# Altium schematic sheet [SH][SW3] V1.0.SchDoc
size A3; PageSetup: Record=PageOptions|CenterHorizontal=True|CenterVertical=True|PrintScale=0.91|XCorrection=1.00|YCorrection=1.00|PrintKind=1|BorderSize=5000000|LeftOffset=0|BottomOffset=0|Orientation=2|PaperLength=3530|PaperWidth=2500|Scale=100|PaperSource=7|PrintQuality=1200|MediaType=1|DitherType=10|PrintScaleMode=1|PaperKind=B4 (ISO)|PaperIndex=42
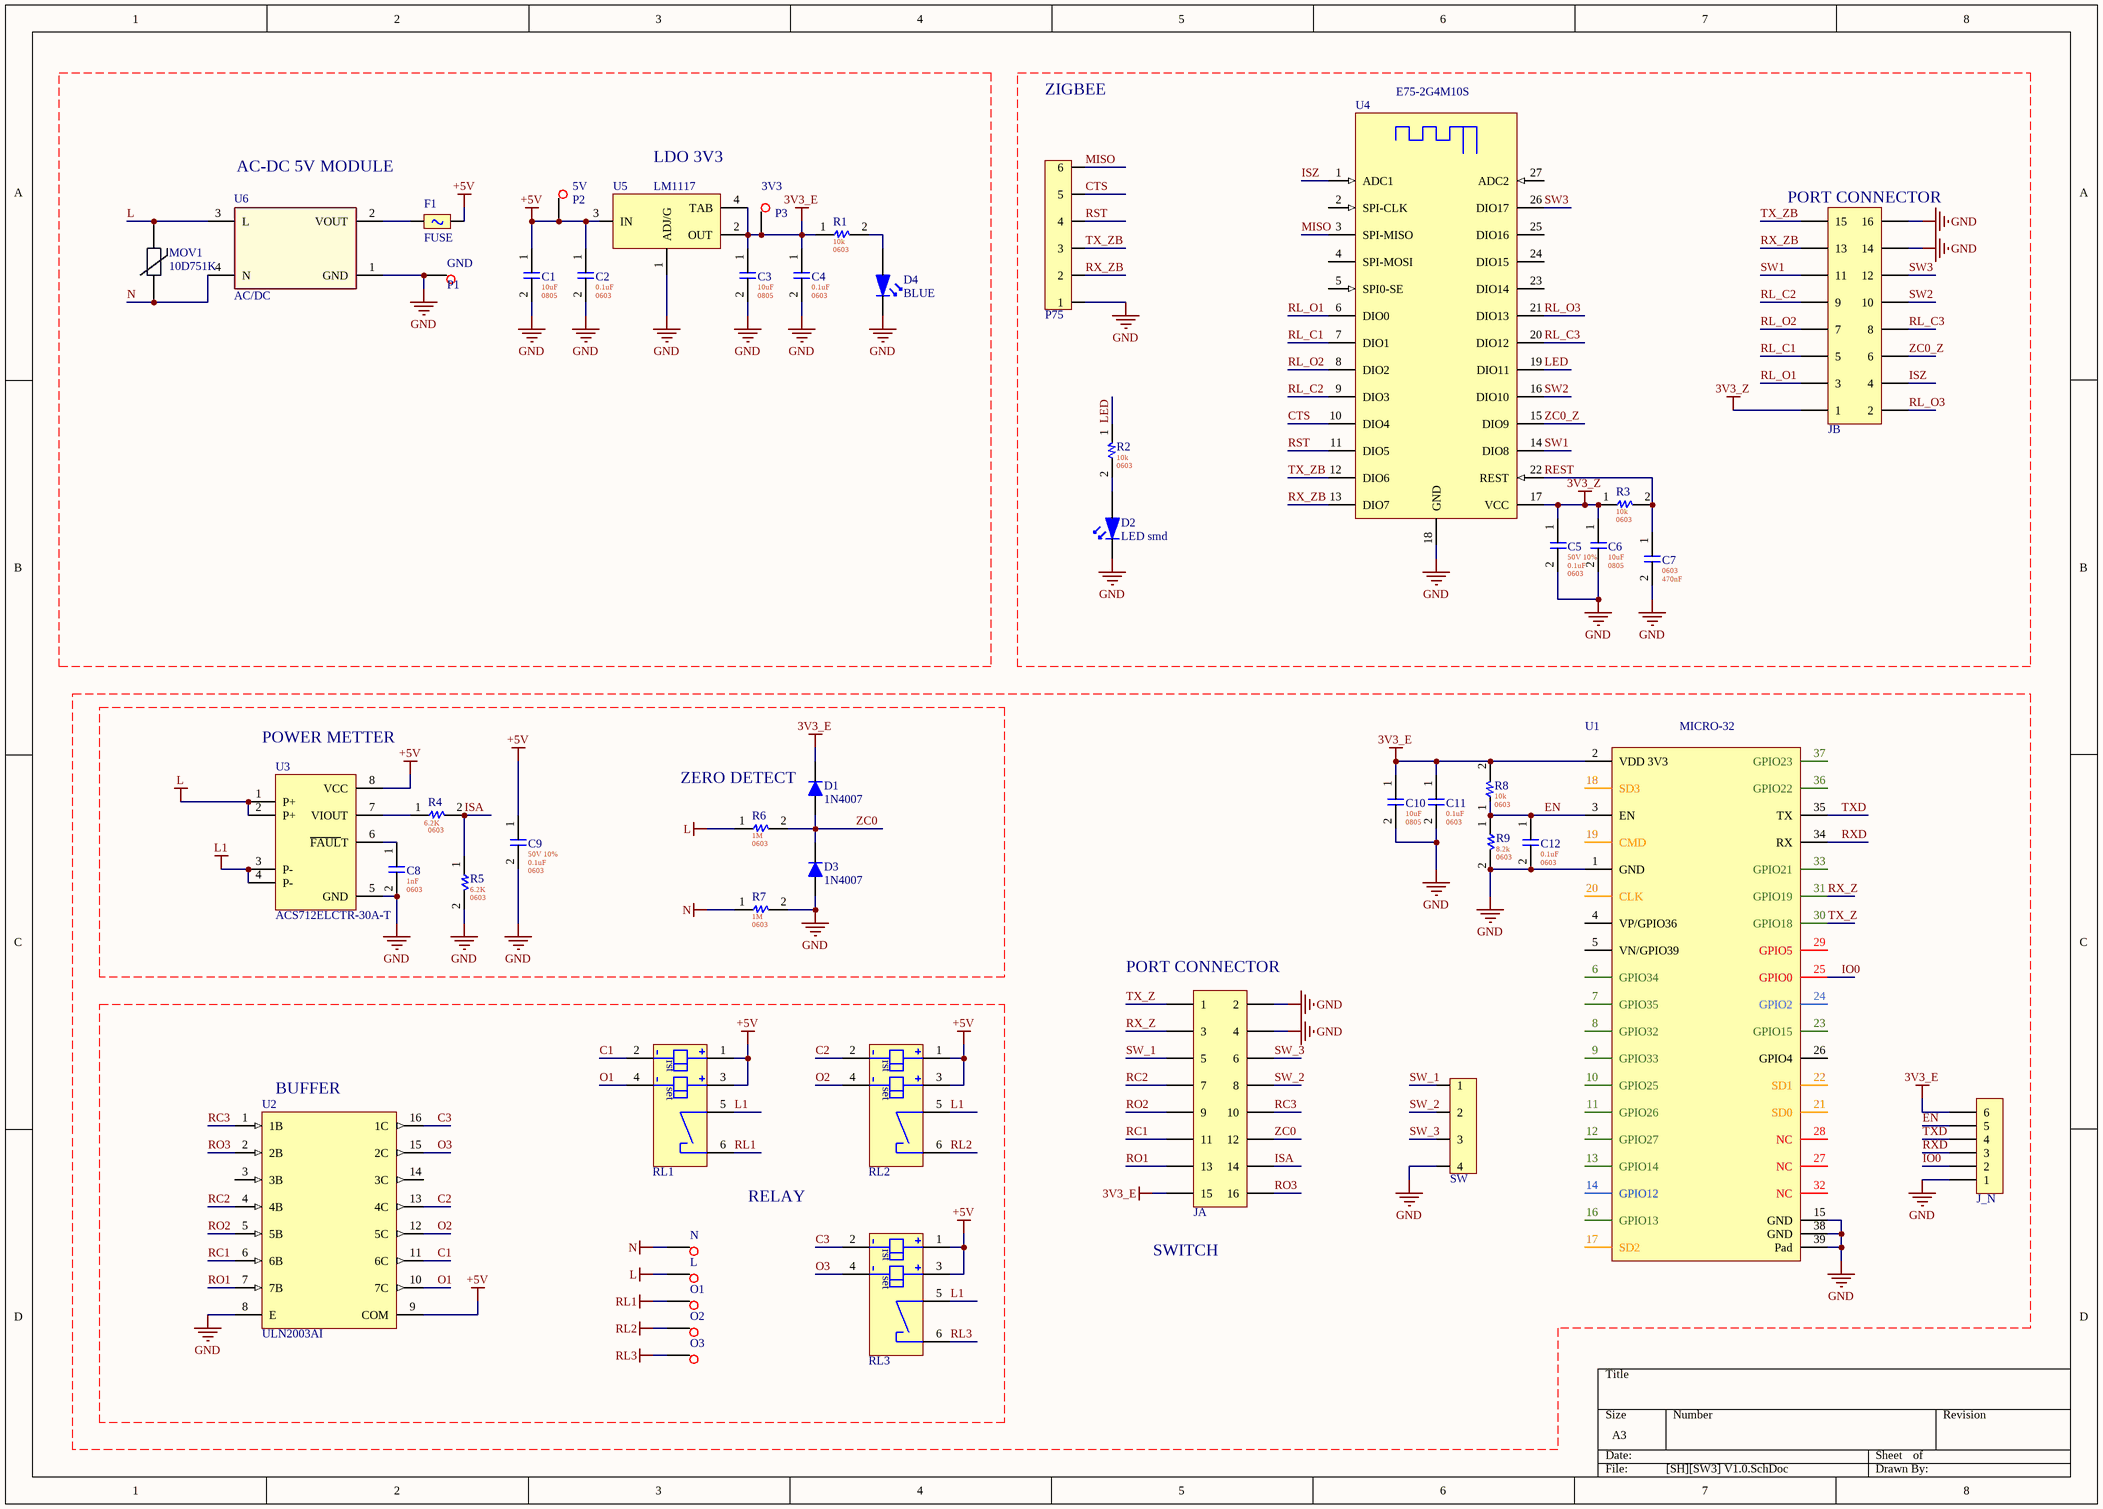
[diagram p0: [SH][SW3] V1.0.SchDoc]

## Parts
3V3  P3  [TEXT_POINT]
5V  P2  [TEXT_POINT]
C1  FP: 0805  [0805 C]  (hidden comment: 10uF)
C2  FP: 0603  [0603 C]  (hidden comment: 0.1uF)
C3  FP: 0805  [0805 C]  (hidden comment: 10uF)
C4  FP: 0603  [0603 C]  (hidden comment: 0.1uF)
C5  VOLTAGE + TOLE: 50V 10%  FP: 0603  [0603 C]  (hidden comment: 0.1uF)
C6  FP: 0805  [0805 C]  (hidden comment: 10uF)
C7  FP: 0603  [0603 C]  (hidden comment: 470nF)
C8  FP: 0603  [0603 C]  (hidden comment: 1nF)
C9  VOLTAGE + TOLE: 50V 10%  FP: 0603  [0603 C]  (hidden comment: 0.1uF)
C10  FP: 0805  [0805 C]  (hidden comment: 10uF)
C11  FP: 0603  [0603 C]  (hidden comment: 0.1uF)
C12  FP: 0603  [0603 C]  (hidden comment: 0.1uF)
D1  1N4007  [SOD-123]
D2  LED smd  [Led 1206]
D3  1N4007  [SOD-123]
D4  BLUE  [Led 1206]
F1  FUSE  [1812]
GND  P1  [TEXT_POINT]
J_N  P6  [P6 - 1.27MM]  (value not drawn)
JA  rao doi  [P2X8 - 2.0mm - female - SMD]  (value not drawn)
JB  rao doi  [P2X8 - 2.0mm - SMD]  (value not drawn)
L  P1  [P1]  (value not drawn)
MOV1  10D751K  [MOV]
N  P1  [P1]  (value not drawn)
O1  P1  [P1]  (value not drawn)
O2  P1  [P1]  (value not drawn)
O3  P1  [P1]  (value not drawn)
P75  P6  [P6 - 1.27MM]  (value not drawn)
R1  FP: 0603  [0603 R]  (hidden comment: 10k)
R2  FP: 0603  [0603 R]  (hidden comment: 10k)
R3  FP: 0603  [0603 R]  (hidden comment: 10k)
R4  value 6.2K  FP: 0603  [0603 R]  (hidden comment: 8.2k)
R5  value 6.2K  FP: 0603  [0603 R]  (hidden comment: 8.2k)
R6  FP: 0603  [0603 R]  (hidden comment: 1M)
R7  FP: 0603  [0603 R]  (hidden comment: 1M)
R8  FP: 0603  [0603 R]  (hidden comment: 10k)
R9  FP: 0603  [0603 R]  (hidden comment: 8.2k)
RL1  RELAY CHOT  [HFE60]  (value not drawn)
RL2  RELAY CHOT  [HFE60]  (value not drawn)
RL3  RELAY CHOT  [HFE60]  (value not drawn)
SW  P4  [P4 2.54 RA header]  (value not drawn)
U1  MICRO-32  [ESP MICRO 32]
U2  ULN2003AI  [SOIC 16]
U3  ACS712ELCTR-30A-T  [SOIC 8]
U4  E75-2G4M10S  [ebyte - E75-2G4M10S]
U5  LM1117  [SOT23-4]
U6  AC/DC  [AC-DC 5V K4H24]

## Nets
3V3_E: 3V3.1(P) C3.1 C4.1 C10.1 C11.1 D1.2 J_N.6 JA.15 R1.1 R8.2 U1.2(VDD_3V3) U5.2(OUT) U5.4(TAB)
3V3_Z: C5.1 C6.1 JB.1 R3.1 U4.17(VCC)
+5V: 5V.1(P) C1.1 C2.1 C9.1 F1.2 RL1.1 RL1.3 RL2.1 RL2.3 RL3.1 RL3.3 U2.9(COM) U3.8(VCC) U5.3(IN)
GND: C1.2 C2.2 C3.2 C4.2 C5.2 C6.2 C7.2 C8.2 C9.2 C10.2 C11.2 C12.2 D2.2 D3.1 D4.2 GND.1(P) J_N.1 JA.2 JA.4 JB.14 JB.16 P75.1 R5.2 R7.2 R9.2 SW.4 U1.1(GND) U1.15(GND) U1.38(GND) U1.39(Pad) U2.8(E) U3.5(GND) U4.18(GND) U5.1(ADJ/G) U6.1(GND)
L: L.1(P) MOV1.2 R6.1 U3.1(P+) U3.2(P+) U6.3(L)
L1: RL1.5 RL2.5 RL3.5 U3.3(P-) U3.4(P-)
N: MOV1.1 N.1(P) R7.1 U6.4(N)
RL1: O1.1(P) RL1.6
RL2: O2.1(P) RL2.6
RL3: O3.1(P) RL3.6
C1: RL1.2 U2.11(6C)
C2: RL2.2 U2.13(4C)
C3: RL3.2 U2.16(1C)
CTS: P75.5 U4.10(DIO4)
EN: C12.1 J_N.5 R8.1 R9.1 U1.3(EN)
IO0: J_N.2 U1.25(GPIO0)
ISA: JA.14 R4.2 R5.1
ISZ: JB.4 U4.1(ADC1)
LED: R2.1 U4.19(DIO11)
MISO: P75.6 U4.3(SPI-MISO)
O1: RL1.4 U2.10(7C)
O2: RL2.4 U2.12(5C)
O3: RL3.4 U2.15(2C)
RC1: JA.11 U2.6(6B)
RC2: JA.7 U2.4(4B)
RC3: JA.10 U2.1(1B)
REST: C7.1 R3.2 U4.22(REST)
RL_C1: JB.5 U4.7(DIO1)
RL_C2: JB.9 U4.9(DIO3)
RL_C3: JB.8 U4.20(DIO12)
RL_O1: JB.3 U4.6(DIO0)
RL_O2: JB.7 U4.8(DIO2)
RL_O3: JB.2 U4.21(DIO13)
RO1: JA.13 U2.7(7B)
RO2: JA.9 U2.5(5B)
RO3: JA.16 U2.2(2B)
RST: P75.4 U4.11(DIO5)
RX_Z: JA.3 U1.31(GPIO19)
RX_ZB: JB.13 P75.2 U4.13(DIO7)
RXD: J_N.3 U1.34(RX)
SW1: JB.11 U4.14(DIO8)
SW2: JB.10 U4.16(DIO10)
SW3: JB.12 U4.26(DIO17)
SW_1: JA.5 SW.1
SW_2: JA.8 SW.2
SW_3: JA.6 SW.3
TX_Z: JA.1 U1.30(GPIO18)
TX_ZB: JB.15 P75.3 U4.12(DIO6)
TXD: J_N.4 U1.35(TX)
ZC0: D1.1 D3.2 JA.12 R6.2
ZC0_Z: JB.6 U4.15(DIO9)
NetC8_1: C8.1 U3.6(~{FAUL}T)
NetD2_1: D2.1 R2.2
NetD4_1: D4.1 R1.2
NetF1_1: F1.1 U6.2(VOUT)
NetR4_1: R4.1 U3.7(VIOUT)

Not connected (* = marked no-connect by the designer): U1 4(VP/GPIO36) 5(VN/GPIO39) 6(GPIO34) 7(GPIO35) 8(GPIO32) 9(GPIO33) 10(GPIO25) 11(GPIO26) 12(GPIO27) 13(GPIO14) 14(GPIO12) 16(GPIO13) 17(SD2) 18(SD3) 19(CMD) 20(CLK) 21(SD0) 22(SD1) 23(GPIO15) 24(GPIO2) 26(GPIO4) 27(NC) 28(NC) 29(GPIO5) 32(NC) 33(GPIO21) 36(GPIO22) 37(GPIO23); U2 3(3B) 14(3C); U4 2(SPI-CLK) 4(SPI-MOSI) 5(SPI0-SE) 23(DIO14) 24(DIO15) 25(DIO16) 27(ADC2)

## Notes on the sheet
- ZIGBEE
- (near U6) AC-DC 5V MODULE
- (near U5) LDO 3V3
- (near JB) PORT CONNECTOR
- (near U3) POWER METTER
- ZERO DETECT
- (near JA) PORT CONNECTOR
- (near U2) BUFFER
- RELAY
- (near JA) SWITCH
- (in symbol RELAY CHOT) rst; set

## Library data of the parts
3V3 5V = P1
C1 C3 C6 C10 = 0805 10uF CER: CAP CER 10uF 50V 10% 0805 SMD; VOLTAGE + TOLE: 50V 10%; PACKAGE: SMD; DATE: 04-Mar-21; CREATOR: MMUOP; ComponentLink1Description: New link; ComponentLink1URL: *; VALUE: 10uF
C2 C4 C11 C12 = 0603 0.1uF CER: CAP CER 0.1uF 50V 10% 0603 SMD; VOLTAGE + TOLE: 50V 10%; PACKAGE: SMD; DATE: 04-Mar-21; CREATOR: MMUOP; ComponentLink1Description: New link; ComponentLink1URL: *; VALUE: 0.1uF
C5 C9 = 0603 0.1uF CER: CAP CER 0.1uF 50V 10% 0603 SMD; PACKAGE: SMD; DATE: 04-Mar-21; CREATOR: MMUOP; ComponentLink1Description: New link; ComponentLink1URL: *; VALUE: 0.1uF
C7 = 0603 470nF CER: CAP CER 470nF 50V 10% 0603 SMD; VOLTAGE + TOLE: 50V 10%; PACKAGE: SMD; DATE: 04-Mar-21; CREATOR: MMUOP; ComponentLink1Description: New link; ComponentLink1URL: *; VALUE: 470nF
C8 = 0603 1nF CER: CAP CER 1nF 50V 10% 0603 SMD; VOLTAGE + TOLE: 50V 10%; PACKAGE: SMD; DATE: 04-Mar-21; CREATOR: MMUOP; ComponentLink1Description: New link; ComponentLink1URL: *; VALUE: 1nF
D1 D3 = Diode schottky: PN: *
D4 = LED smd
JA JB = P2x8
MOV1 = VARISTOR: 750V
R1-R3 R8 = 0603 10k 1%: 10k 1% 0603 SMD; PN: C98220; PACKAGE: SMD; DATE: 04-Mar-21; CREATOR: MMUOP; ComponentLink1Description: New link; ComponentLink1URL: *; VOLTAGE + TOLE: 1%; VALUE: 10k
R4 R5 R9 = 0603 8.2k 1%: 8.2k 1% 0603 SMD; PACKAGE: SMD; DATE: 04-Mar-21; CREATOR: MMUOP; ComponentLink1Description: New link; ComponentLink1URL: *; VOLTAGE + TOLE: 1%
  R9: VALUE: 8.2k
R6 R7 = 0603 1M 1%: 1M 1% 0603 SMD; PACKAGE: SMD; DATE: 04-Mar-21; CREATOR: MMUOP; ComponentLink1Description: New link; ComponentLink1URL: *; VOLTAGE + TOLE: 1%; VALUE: 1M
U1 = ESP MICRO-32_FIX
U2 = ULN2003AI: TRANS 7NPN DARL 50V 0.5A 16SO; Supplier 1: Digi-Key; Supplier Part Number 1: 296-29404-1-ND
U3 = ACS71240: ACS712ELCTR-20A  SOIC 8; ComponentLink1Description: New link; ComponentLink1URL: https://banlinhkiendientu.vn/acs712t/
U4 = ebyte - E75-2G4M10S